# EAGLE design voltreg (EAGLE 9.6.2)
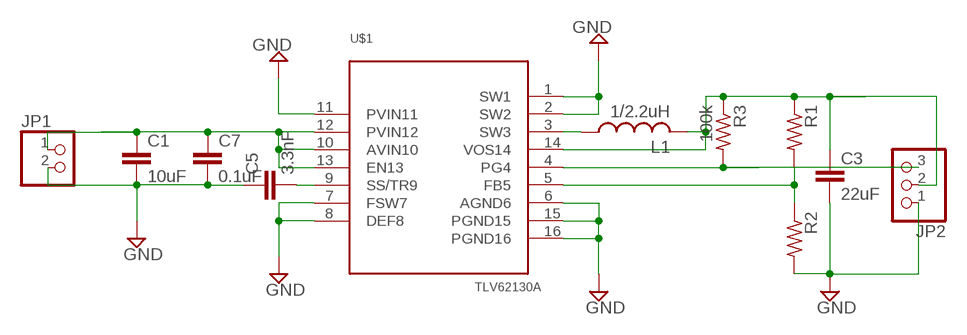
[diagram p0: schematic, sheet 1]

## Parts
C1  10uF  C-EUC0805  [C0805]
C3  22uF  C-EUC0805  [C0805]
C5  3.3nF  C-EUC0805  [C0805]
C7  0.1uF  C-EUC0805  [C0805]
JP1  PINHD-1X2  [1X02]
JP2  PINHD-1X3  [1X03]
L1  1/2.2uH  L-USL3225M  [L3225M]
R1  R-US_R0805  [R0805]
R2  R-US_R0805  [R0805]
R3  100k  R-US_R0805  [R0805]
U$1  TLV62130A  [TLV62130A]

## Nets
GND: C1.2 C3.2 C5.1 C7.2 JP1.2 JP2.1 R2.2 U$1.1(SW1) U$1.2(SW2) U$1.6(AGND6) U$1.7(FSW7) U$1.8(DEF8) U$1.11(PVIN11) U$1.15(PGND15) U$1.16(PGND16)
N$1: L1.1 U$1.3(SW3)
N$2: C3.1 JP2.2 L1.2 R1.1 R3.1 U$1.14(VOS14)
N$3: JP2.3 R3.2 U$1.4(PG4)
N$4: R1.2 R2.1 U$1.5(FB5)
N$5: C1.1 C7.1 JP1.1 U$1.10(AVIN10) U$1.12(PVIN12) U$1.13(EN13)
N$7: C5.2 U$1.9(SS/TR9)

## Library data of the parts
C1 C3 C5 C7 = rcl:C-EU: CAPACITOR, European symbol; SPICEPREFIX: C
JP1 = pinhead:PINHD-1X2: PIN HEADER
JP2 = pinhead:PINHD-1X3: PIN HEADER
L1 = rcl:L-US: INDUCTOR, American symbol; SPICEPREFIX: L
R1-R3 = rcl:R-US_: RESISTOR, American symbol; SPICEPREFIX: R
U$1 = tlv62130a:TLV62130A

## Board
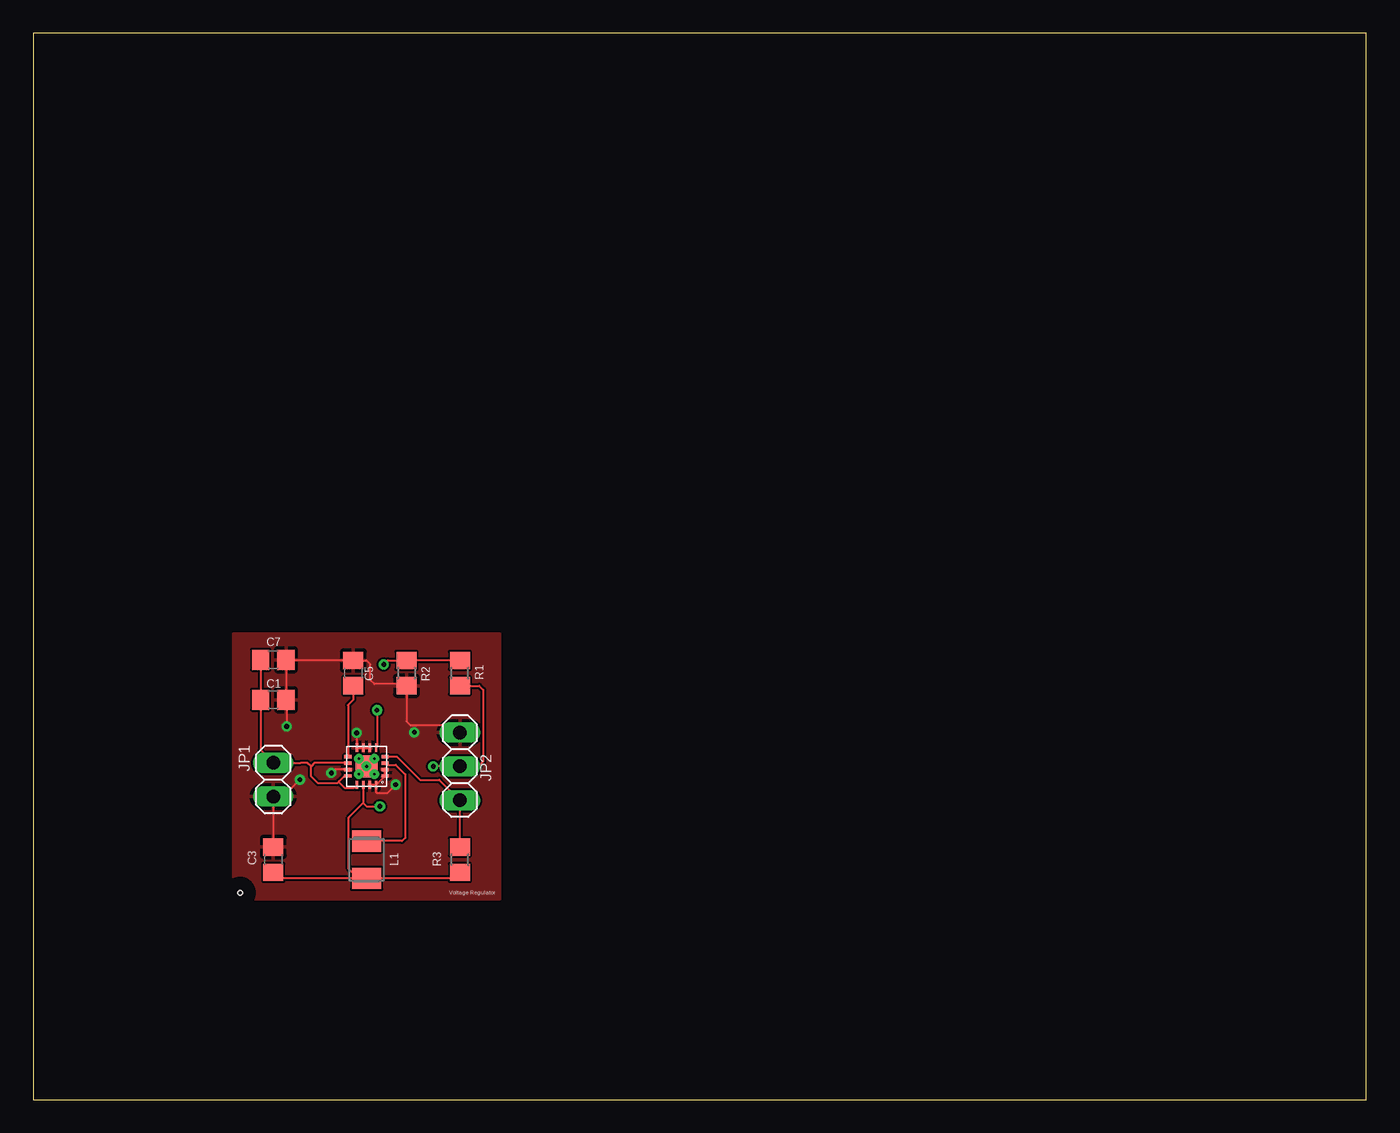
[diagram p1: board, top side]
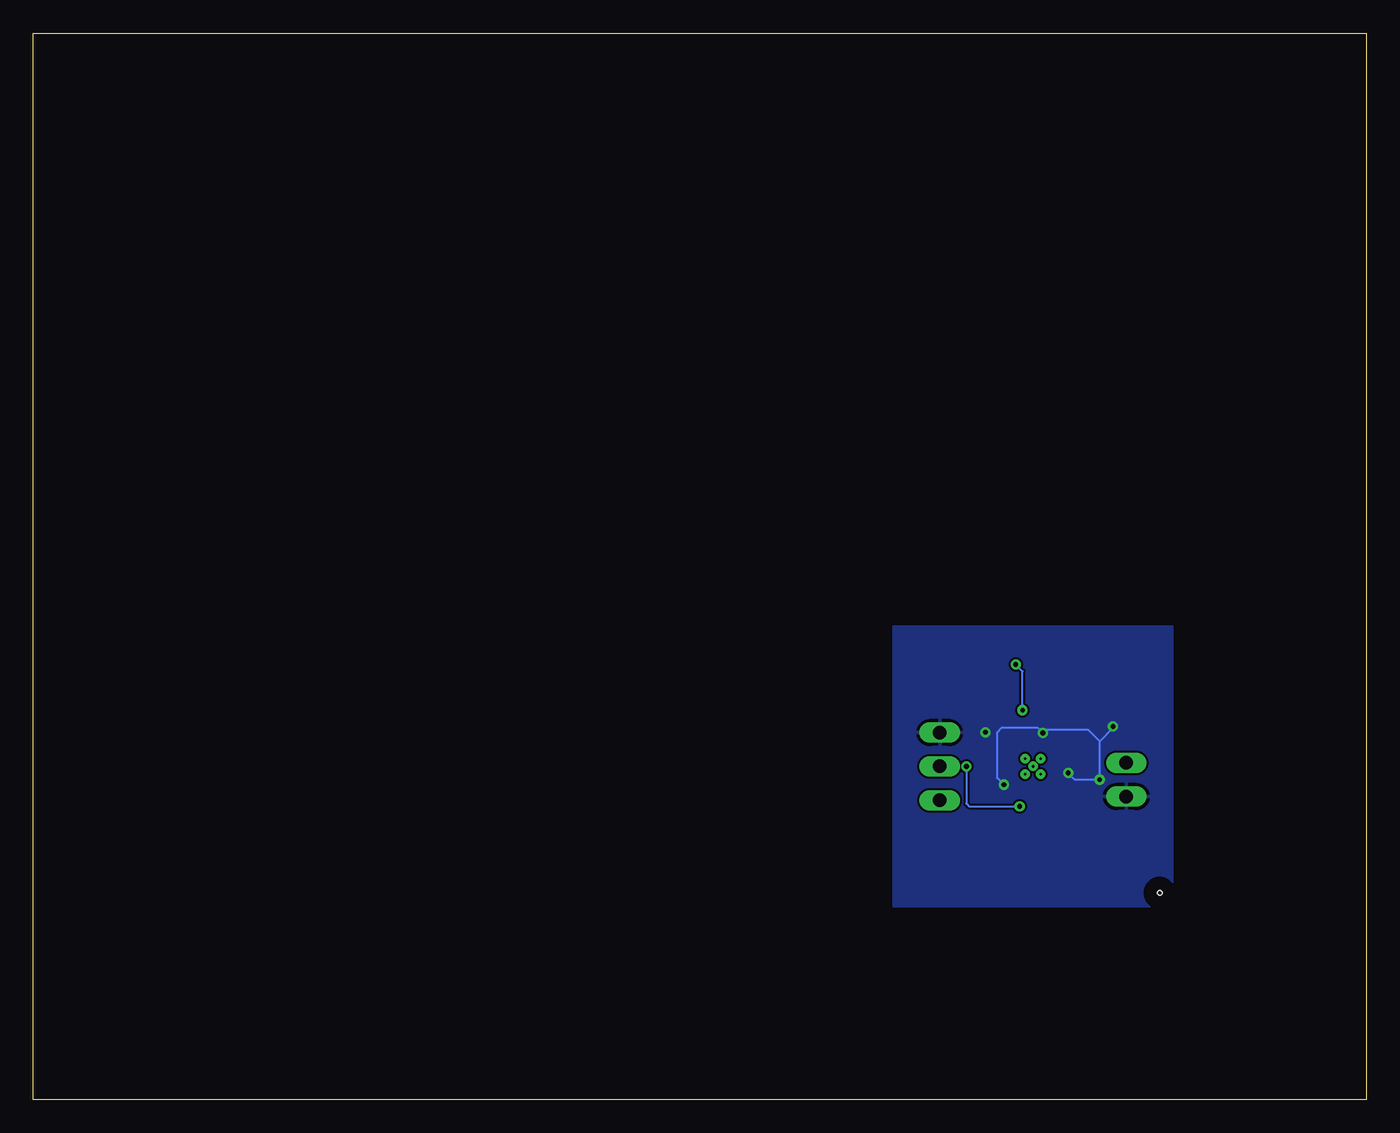
[diagram p2: board, bottom side, seen from below]

Size 100 x 80 mm. Coordinates in mm from the lower left corner, seen from the top.
Outline: 0,0 100,0 100,80 0,80 0,0
Copper layers (1*16): Top 0.035mm / dielectric 1.5mm / Bottom 0.035mm
Design rules "default *": minimum track width 6mil, minimum drill 0.2mm, track to track 6mil, track to pad 6mil, pad to pad 6mil, via to via 6mil, smd to smd 6mil, copper to edge 40mil, drill to drill 6mil, minimum pad ring 10mil, minimum via ring 8mil, stop-mask expansion 4mil, vias tented up to drill 0mil, thermal gap 10mil
Holes 0.35 mm at 15.5,15.5

### Footprints (pad centres in the part's own frame; a part is rotated, then mirrored left to right if it is on the bottom)
C0805 = smd 1.3 x 1.5: 1 -0.95,0; 2 0.95,0
1X02 = drill 1.016 long: 1 -1.27,0; 2 1.27,0
1X03 = drill 1.016 long: 1 -2.54,0; 2 0,0; 3 2.54,0
L3225M = smd 1.6 x 2.2: 1 -1.4,0; 2 1.4,0
R0805 = smd 1.3 x 1.5: 1 -0.95,0; 2 0.95,0
TLV62130A = smd 0.6 x 0.24: 1 -1.4,0.72; 2 -1.4,0.24; 3 -1.4,-0.24; 4 -1.4,-0.72; 9 1.4,-0.72; 10 1.4,-0.24; 11 1.4,0.24; 12 1.4,0.72 | smd 0.24 x 0.6: 5 -0.72,-1.4; 6 -0.24,-1.4; 7 0.24,-1.4; 8 0.72,-1.4; 13 0.72,1.4; 14 0.24,1.4; 15 -0.24,1.4; 16 -0.72,1.4 | drill 0.2 pad 0.27: P$22 0,0; V1 -0.58,0.58; V2 -0.58,-0.58; V3 0.58,-0.58; V4 0.58,0.58 | smd 1.68 x 1.68: PAD 0,0

### Placement (x,y rotation side)
C1  18,30 0 top
C3  18,18 90 top
C5  24,32 270 top
C7  18,33 0 top
JP1  18,24 270 top
JP2  32,25 270 top
L1  25,18 270 top
R1  32,32 90 top
R2  28,32 270 top
R3  32,18 90 top
U$1  25,25 180 top

### Tracks (layer width: path | path; a pad name or v marks a point on that pad's centre or on a via)
GND  (via drill 0.35)
  Top 0.152: C3.2 JP1.2 18.64,23.36 19.4,23.36 20,23.97 v20,24 | JP2.1 31.47,28.07 28.32,28.07 28,28.38 R2.2 27.87,31.18 25.59,31.18 25.27,31.5 25.27,32.64 25.29,32.66 25,32.95 C5.1 23.95,33 C7.2 C1.2 19,29.95 v19,28 | U$1.6 U$1.7 U$1.8 24.28,26.41 24.25,26.44 v24.25,27.51 | U$1.15 U$1.16 | U$1.16 U$1.1 U$1.2 | U$1.11 22.6,24.76 v22.35,24.51 | v27.18,23.62 26.54,22.99 25.78,22.99 25.72,23.05 U$1.16
  Bottom 0.152: 20,26.87 19,27.87 v19,28 | v22.35,24.51 21.84,24 v20,24 20,26.87 | 20,26.87 20.89,27.76 24,27.76 v24.25,27.51 24.62,27.87 27.37,27.87 27.69,27.56 27.69,24.13 v27.18,23.62
  other vias: 28.57,27.56
  pour Top: 15,35 35,35 35,15 15,15
  pour Bottom: 14.5,35.5 35.5,35.5 35.5,14.5 14.5,14.5
N$1
  Top 0.152: U$1.3 26.53,25.11 27.18,25.11 27.9,24.4 27.9,19.63 27.67,19.4 L1.1
N$2  (via drill 0.35)
  Top 0.152: R1.1 33.45,31.05 33.75,30.74 33.75,25.36 33.4,25 JP2.2 v30,25 | L1.2 24.38,16.6 23.67,17.31 23.67,21.15 24.76,22.24 | U$1.14 24.76,22.24 | 24.76,22.24 25,22 v26,22 | L1.2 18.45,16.6 C3.1 | R3.1 31.55,16.6 L1.2
  Bottom 0.152: v30,25 30,22.21 29.79,22 v26,22
N$3
  Top 0.152: R3.2 JP2.3 30.46,24 29,24 27.28,25.72 U$1.4
N$4  (via drill 0.35)
  Top 0.152: R1.2 R2.1 26.6,32.95 v26.29,32.64 | v25.78,29.21 25.78,26.46 U$1.5
  Bottom 0.152: v25.78,29.21 25.78,32.13 v26.29,32.64
N$5
  Top 0.152: C7.1 C1.1 17.05,26.22 JP1.1 20.06,25.27 20.07,25.27 20.55,25.27 20.83,25 | U$1.12 23.35,24.28 22.94,23.88 | 22.94,23.88 22.82,23.75 21.34,23.75 20.83,24.26 20.83,25 | 22.94,23.88 22.94,23.81 23.4,23.35 24.03,23.35 U$1.13 | U$1.10 21.07,25.24 20.83,25
N$7
  Top 0.152: C5.2 24,30 23.6,29.6 U$1.9

### Text on the board
tNames: Voltage Regulator